# Altium schematic sheet nutnhanguyen ly.SchDoc
size A3
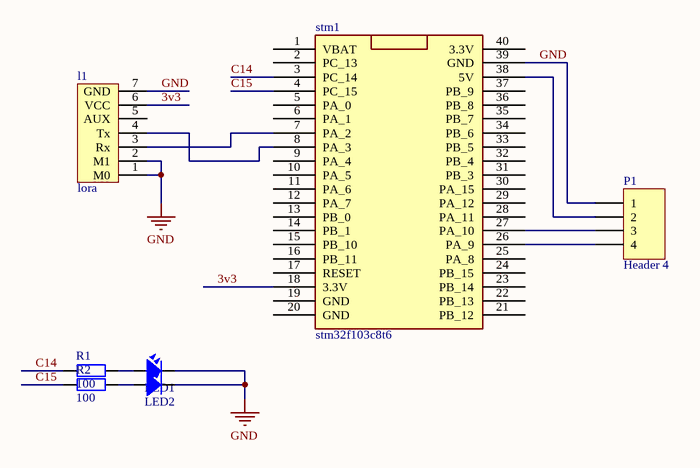
[diagram p0: nutnhanguyen ly.SchDoc]

## Parts
l1  lora  [lora sx1278]
LED1  LED  [LED-5-RED]  (value not drawn)
LED2  LED  [LED-5-RED]  (value not drawn)
P1  Header 4  [HDR1X4]
R1  100  [R1/4W]
R2  100  [R1/4W]
stm1  stm32f103c8t6  [40chan]

## Nets
GND: l1.1(M0) l1.2(M1) l1.7(GND) LED1.2 LED2.2 P1.1 stm1.39(GND)
3v3: l1.6(VCC) stm1.18(3.3V)
C14: R1.1 stm1.3(PC_14)
C15: R2.1 stm1.4(PC_15)
Netl1_3: l1.3(Rx) stm1.7(PA_2)
Netl1_4: l1.4(Tx) stm1.8(PA_3)
NetLED1_1: LED1.1 R1.2
NetLED2_1: LED2.1 R2.2
NetP1_2: P1.2 stm1.38(5V)
NetP1_3: P1.3 stm1.27(PA_10)
NetP1_4: P1.4 stm1.26(PA_9)

Not connected (* = marked no-connect by the designer): l1 5(AUX); stm1 1(VBAT) 2(PC_13) 5(PA_0) 6(PA_1) 9(PA_4) 10(PA_5) 11(PA_6) 12(PA_7) 13(PB_0) 14(PB_1) 15(PB_10) 16(PB_11) 17(RESET) 19(GND) 20(GND) 21(PB_12) 22(PB_13) 23(PB_14) 24(PB_15) 25(PA_8) 28(PA_11) 29(PA_12) 30(PA_15) 31(PB_3) 32(PB_4) 33(PB_5) 34(PB_6) 35(PB_7) 36(PB_8) 37(PB_9) 40(3.3V)

## Library data of the parts
l1 = lora SX1278
LED1 LED2 = LED: LED Single colour Green and Red; Value: LED 3 ly Single Colour
P1 = Header 4: Header, 4-Pin; LatestRevisionDate: 17-Jul-2002; LatestRevisionNote: Re-released for DXP Platform.; Publisher: Altium Limited
R1 R2 = R1/4W: Resistor 1/4W; Value: R1/4W - 1K